# EAGLE design Garage_Pi (EAGLE 7.4.0)
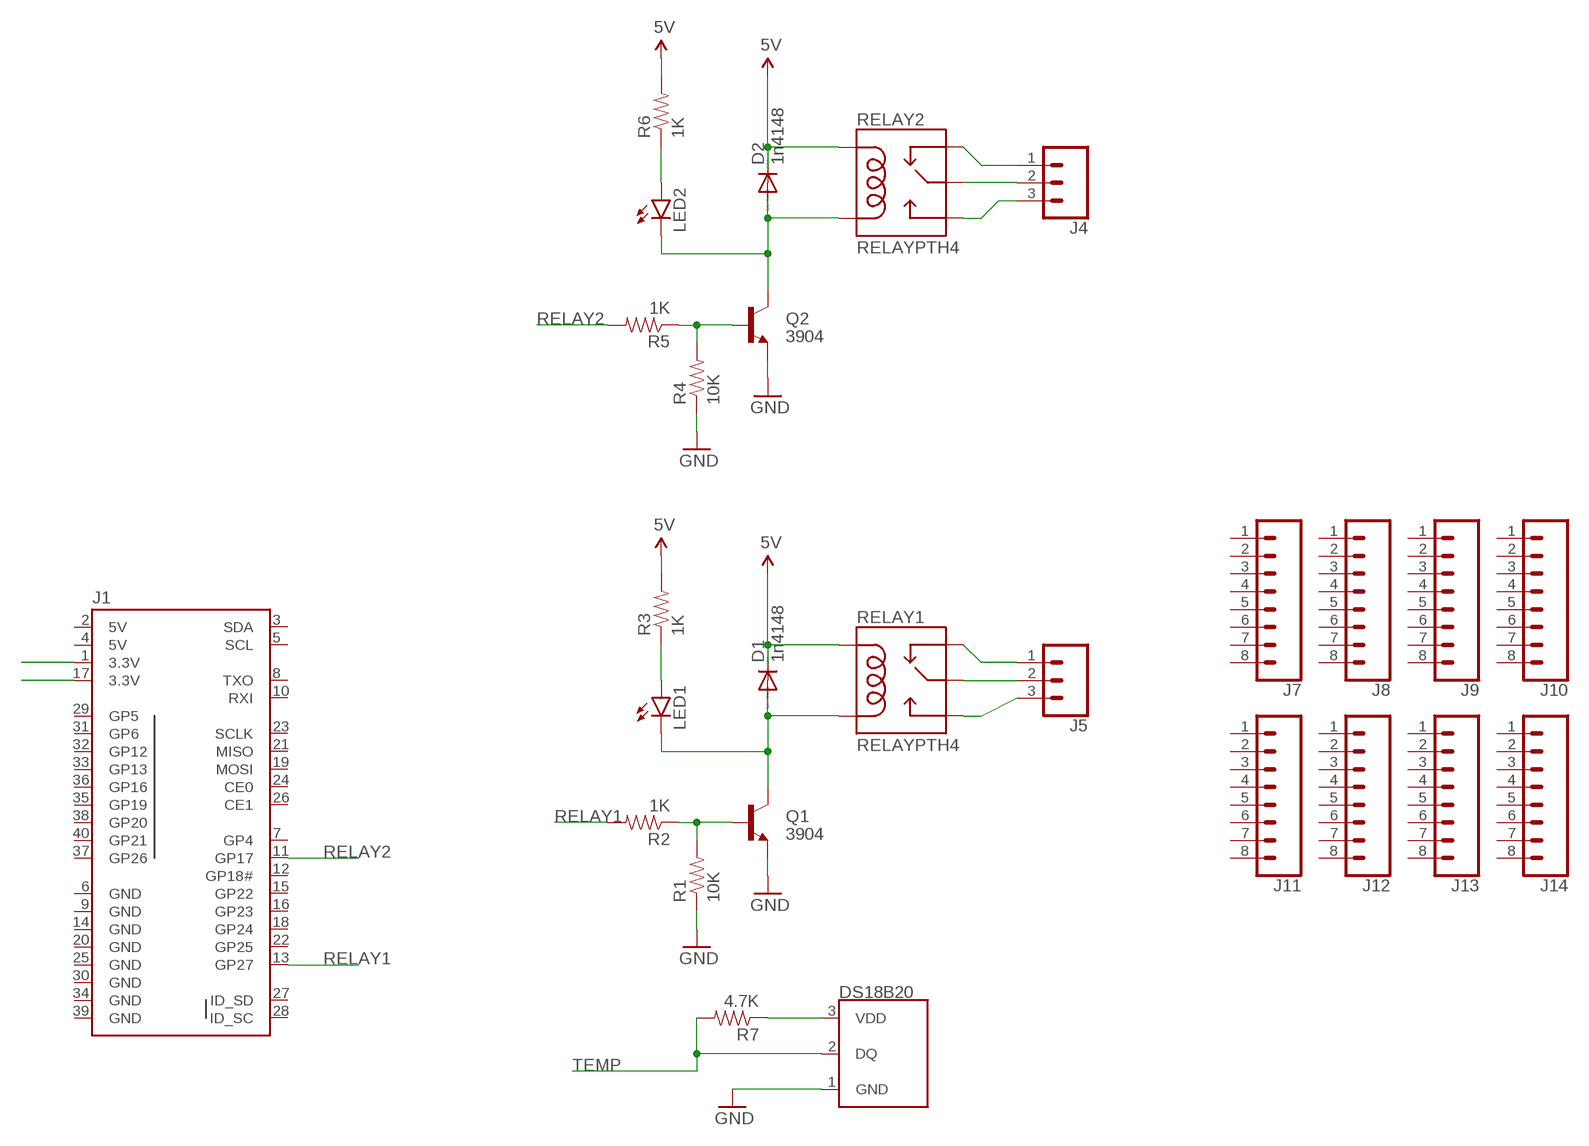
[diagram p0: schematic, sheet 1]

## Parts
D1  1n4148  CGRM4001-G  [SOD-123_MINI-SMA]
D2  1n4148  CGRM4001-G  [SOD-123_MINI-SMA]
DS18B20  DS18B20  [TO-92-AMMO]
J1  RASPBERRYPI-40-PIN-GPIO_PTH  [2X20_SHROUDED]
J4  CONN_03SCREW  [SCREWTERMINAL-3.5MM-3]
J5  CONN_03SCREW  [SCREWTERMINAL-3.5MM-3]
J7  CONN_08NO_SILK_FEMALE_PTH  [1X08_NO_SILK]
J8  CONN_08NO_SILK_FEMALE_PTH  [1X08_NO_SILK]
J9  CONN_08NO_SILK_FEMALE_PTH  [1X08_NO_SILK]
J10  CONN_08NO_SILK_FEMALE_PTH  [1X08_NO_SILK]
J11  CONN_08NO_SILK_FEMALE_PTH  [1X08_NO_SILK]
J12  CONN_08NO_SILK_FEMALE_PTH  [1X08_NO_SILK]
J13  CONN_08NO_SILK_FEMALE_PTH  [1X08_NO_SILK]
J14  CONN_08NO_SILK_FEMALE_PTH  [1X08_NO_SILK]
LED1  LED-FKIT-1206  [FKIT-LED-1206]
LED2  LED-FKIT-1206  [FKIT-LED-1206]
Q1  3904  TRANSISTOR_NPNSOT23-3  [SOT23-3]
Q2  3904  TRANSISTOR_NPNSOT23-3  [SOT23-3]
R1  10K  RESISTOR0805-RES  [0805]
R2  1K  RESISTOR0805-RES  [0805]
R3  1K  RESISTOR0805-RES  [0805]
R4  10K  RESISTOR0805-RES  [0805]
R5  1K  RESISTOR0805-RES  [0805]
R6  1K  RESISTOR0805-RES  [0805]
R7  4.7K  RESISTOR0805-RES  [0805]
RELAY1  RELAYPTH4  [RELAY-JZC]
RELAY2  RELAYPTH4  [RELAY-JZC]

## Nets
3.3V: DS18B20.3(VDD) J1.1(3.3V) R7.1
5V: D1.C D2.C R3.2 R6.2 RELAY1.5(COIL1) RELAY2.5(COIL1)
COM1: J5.2 RELAY1.4(MAIN)
COM2: J4.2 RELAY2.4(MAIN)
GND: DS18B20.1(GND) Q1.2(E) Q2.2(E) R1.1 R4.1
N$1: Q1.1(B) R1.2 R2.1
N$2: D1.A LED1.C Q1.3(C) RELAY1.1(COIL2)
N$4: LED1.A R3.1
N$5: J1.17(3.3V)
N$7: D2.A LED2.C Q2.3(C) RELAY2.1(COIL2)
N$8: Q2.1(B) R4.2 R5.1
N$9: LED2.A R6.1
NC1: J5.1 RELAY1.2(NC)
NC2: J4.1 RELAY2.2(NC)
NO1: J5.3 RELAY1.3(NO)
NO2: J4.3 RELAY2.3(NO)
RELAY1: J1.13(GP27) R2.2
RELAY2: J1.11(GP17) R5.2
TEMP: DS18B20.2(DQ) R7.2
Unconnected: J1.3(SDA) J1.5(SCL) J1.7(GP4) J1.8(TXO) J1.10(RXI) J1.12(GP18#) J1.15(GP22) J1.16(GP23) J1.18(GP24) J1.19(MOSI) J1.21(MISO) J1.22(GP25) J1.23(SCLK) J1.24(CE0) J1.26(CE1) J1.27(ID_SD) J1.28(ID_SC) J1.29(GP5) J1.31(GP6) J1.32(GP12) J1.33(GP13) J1.35(GP19) J1.36(GP16) J1.37(GP26) J1.38(GP20) J1.40(GP21) J7.1 J7.2 J7.3 J7.4 J7.5 J7.6 J7.7 J7.8 J8.1 J8.2 J8.3 J8.4 J8.5 J8.6 J8.7 J8.8 J9.1 J9.2 J9.3 J9.4 J9.5 J9.6 J9.7 J9.8 J10.1 J10.2 J10.3 J10.4 J10.5 J10.6 J10.7 J10.8 J11.1 J11.2 J11.3 J11.4 J11.5 J11.6 J11.7 J11.8 J12.1 J12.2 J12.3 J12.4 J12.5 J12.6 J12.7 J12.8 J13.1 J13.2 J13.3 J13.4 J13.5 J13.6 J13.7 J13.8 J14.1 J14.2 J14.3 J14.4 J14.5 J14.6 J14.7 J14.8

## Power pins joined to a net without a drawn wire
5V: J1.2(5V) J1.4(5V)
GND: J1.6(GND) J1.9(GND) J1.14(GND) J1.20(GND) J1.25(GND) J1.30(GND) J1.34(GND) J1.39(GND)

## Library data of the parts
D1 D2 = diode:CGRM400*-G: Molded plasitc,JEDEC SOD-123/Mini SMA Source: Comchip CGRM4001-G.pdf
DS18B20 = SparkFun-Sensors:DS18B20: Dallas/Maxim DS18B20 1-Wire Temperature Sensor The DS18B20 reports degrees C with 9 to 12-bit precision, -55C to 125C (+/-0.5C). Each sensor has a unique 64-Bit Serial number etched into it - allows for a huge number of sensors to be used on one data bus. Datasheet <http://datasheets.maximintegrated.com/en/ds/DS18B20.pdf> SparkFun Products One Wire Digital Temperature Sensor - DS18B20 <https://www.sparkfun.com/products/245> (SEN-00245); STORE_ID: SEN-00245
J1 = SparkFun-Connectors:RASPBERRYPI-40-PIN-GPIO: Raspberry Pi GPIO Header 2x20 pin connector, as found on B, B+, A+ models. Both shrouded PTH and SMT versions available. SparkFun Products: GPIO Shrouded Header <https://www.sparkfun.com/products/13054>- PTH SparkFun Pi Wedge (Preassembled) <https://www.sparkfun.com/products/13717>; PROD_ID: CONN-12263; SF_ID: PRT-13054
J4 J5 = SparkFun-Connectors:CONN_03: Multi connection point. Often used as Generic Header-pin footprint for 0.1 inch spaced/style header connections On any of the 0.1 inch spaced packages, you can populate with these: Break Away Headers - Straight <https://www.sparkfun.com/products/116> (PRT-00116) Break Away Male Headers - Right Angle <https://www.sparkfun.com/products/553> (PRT-00553) Female Headers <https://www.sparkfun.com/products/115> (PRT-00115) Break Away Headers - Machine Pin <https://www.sparkfun.com/products/117> (PRT-00117) Break Away Female Headers - Swiss Machine Pin <https://www.sparkfun.com/products/743> (PRT-00743) Stackable Header - 3 Pin (Female, 0.1") <https://www.sparkfun.com/products/13875> (PRT-13875) For SCREWTERMINALS and SPRING TERMINALS visit here: Screw Terimnals on SparkFun.com <https://www.sparkfun.com/search/results?term=Screw+Terminals> (5mm/3.5mm/2.54mm spacing) This device is also useful as a general connection point to wire up your design to another part of your project. Our various solder wires solder well into these plated through hole pads. Hook-Up Wire - Assortment (Stranded, 22 AWG) <https://www.sparkfun.com/products/11375> (PRT-11375) Hook-Up Wire - Assortment (Solid Core, 22 AWG) <https://www.sparkfun.com/products/11367> (PRT-11367) View the entire wire category on our website here <https://www.sparkfun.com/categories/141> Special notes: Molex polarized connector foot print use with SKU : PRT-08232 with associated crimp pins and housings.; PROD_ID: CONN-08288; SF_ID: PRT-08235
J7-J14 = SparkFun-Connectors:CONN_08: Multi connection point. Often used as Generic Header-pin footprint for 0.1 inch spaced/style header connections On any of the 0.1 inch spaced packages, you can populate with these: Break Away Headers - Straight <https://www.sparkfun.com/products/116> (PRT-00116) Break Away Male Headers - Right Angle <https://www.sparkfun.com/products/553> (PRT-00553) Female Headers <https://www.sparkfun.com/products/115> (PRT-00115) Break Away Headers - Machine Pin <https://www.sparkfun.com/products/117> (PRT-00117) Break Away Female Headers - Swiss Machine Pin <https://www.sparkfun.com/products/743> (PRT-00743) Arduino Stackable Header - 8 Pin <https://www.sparkfun.com/products/9279> (PRT-09279) For SCREWTERMINALS and SPRING TERMINALS visit here: Screw Terimnals on SparkFun.com <https://www.sparkfun.com/search/results?term=Screw+Terminals> (5mm/3.5mm/2.54mm spacing) This device is also useful as a general connection point to wire up your design to another part of your project. Our various solder wires solder well into these plated through hole pads. Hook-Up Wire - Assortment (Stranded, 22 AWG) <https://www.sparkfun.com/products/11375> (PRT-11375) Hook-Up Wire - Assortment (Solid Core, 22 AWG) <https://www.sparkfun.com/products/11367> (PRT-11367) View the entire wire category on our website here <https://www.sparkfun.com/categories/141> Special notes: Molex polarized connector foot print use with SKU : PRT-08231 with associated crimp pins and housings. 1MM SMD Version SKU: PRT-10208 NOTES ON THE VARIANTS LOCK and LOCK_LONGPADS... This footprint was designed to help hold the alignment of a through-hole component (i.e. 6-pin header) while soldering it into place. You may notice that each hole has been shifted either up or down by 0.005 of an inch from it's more standard position (which is a perfectly straight line). This slight alteration caused the pins (the squares in the middle) to touch the edges of the holes. Because they are alternating, it causes a "brace" to hold the component in place. 0.005 has proven to be the perfect amount of "off-center" position when using our standard breakaway headers. Although looks a little odd when you look at the bare footprint, once you have a header in there, the alteration is very hard to notice. Also,if you push a header all the way into place, it is covered up entirely on the bottom side.; PROD_ID: CONN-08438
LED1 LED2 = SparkFun-LED:LED: LEDs Standard schematic elements and footprints for 5mm, 3mm, 1206, and 0603 sized LEDs. 5mm - Spark Fun Electronics SKU : COM-00529 (and others)
Q1 Q2 = SparkFun-DiscreteSemi:TRANSISTOR_NPN: Generic NPN BJT MMBT2222A - TRANS-08049 (SOT-23, 1A 40V) MPSA42 - TRANS-09116 (SOT-23, 500mA 300V) MMBT5088LT1G - TRANS-11160 (SOT-23, 50 mA 30V) BC547 - COM-08928 <http://www.sparkfun.com/products/8928> (TO-92 45V 100mA) (1.Collector 2.Base 3.Emitter) 2N3904 - COM-00521 <http://www.sparkfun.com/products/521> (TO-92 40V 200mA) (1.Emitter 2.Base 3.Collector) P2N2222A - COM-12852 <http://www.sparkfun.com/products/12852> (TO-92 40V 600mA) (1.Collector 2.Base 3.Emitter); PROD_ID: TRANS-08049
R1-R7 = SparkFun-Passives:RESISTOR: Resistor Basic schematic elements and footprints for 0603, 1206, and PTH resistors.
RELAY1 RELAY2 = SparkFun-Electromechanical:RELAY: SPDT relay (COM-00101)

## Board
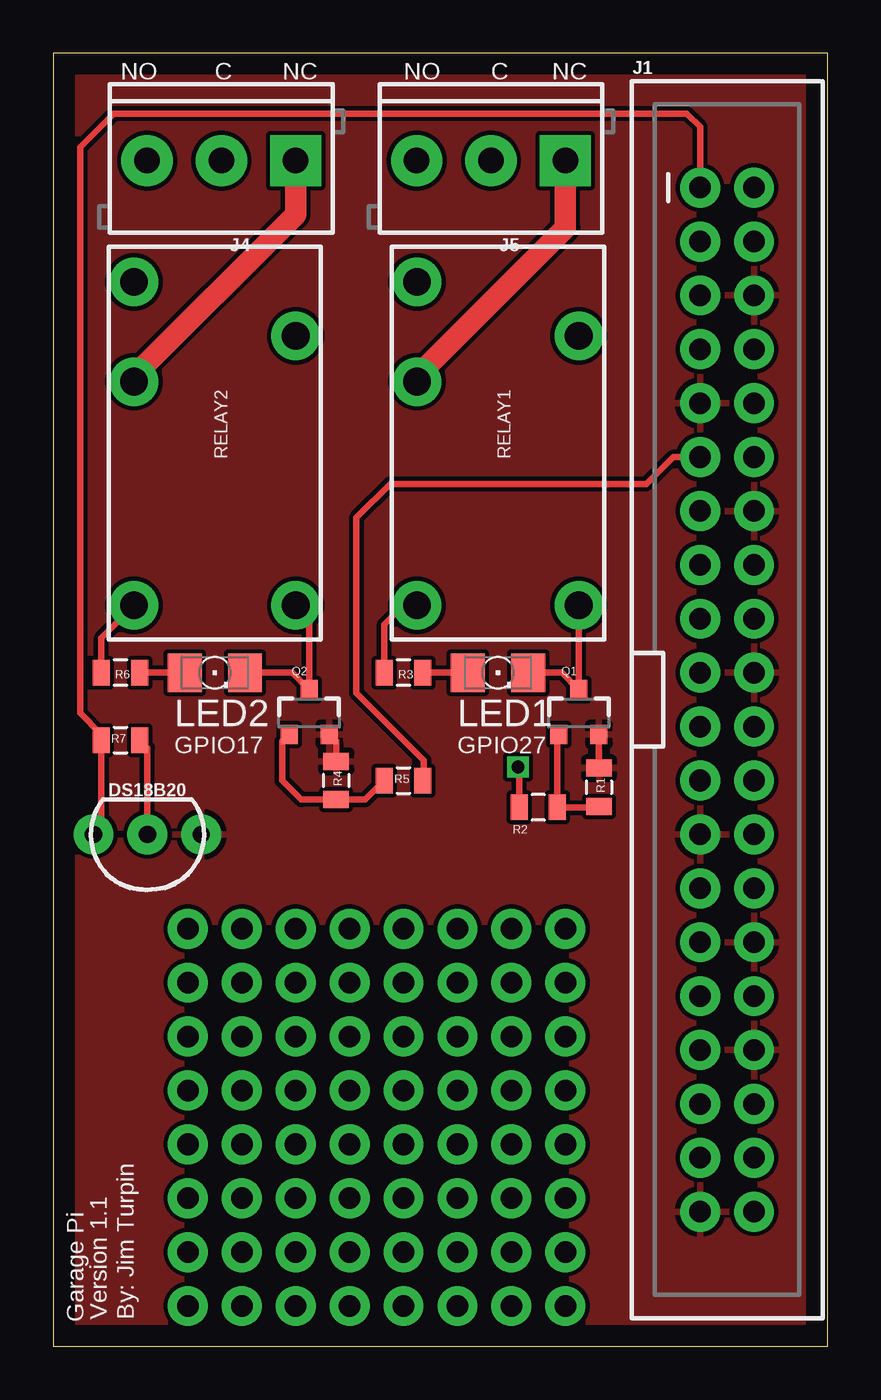
[diagram p1: board, top side]
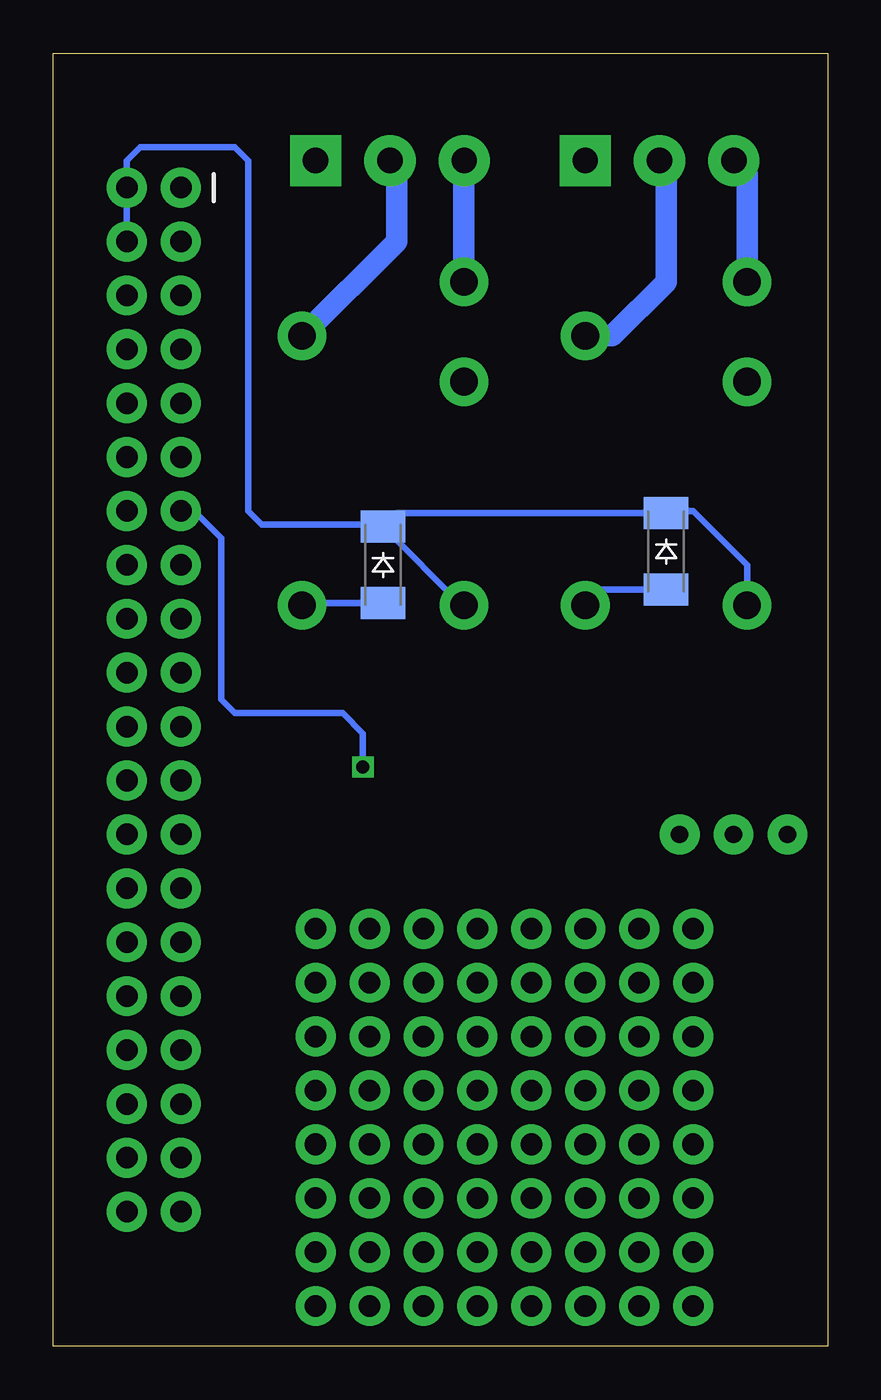
[diagram p2: board, bottom side, seen from below]

Size 36.5 x 60.95 mm. Coordinates in mm from the lower left corner, seen from the top.
Outline: 0,0 36.5,0 36.5,60.95 0,60.95 0,0
Copper layers (1*16): Top 0.035mm / dielectric 1.5mm / Bottom 0.035mm
Design rules "default": minimum track width 10mil, minimum drill 24mil, track to track 8mil, track to pad 8mil, pad to pad 8mil, via to via 8mil, smd to smd 8mil, copper to edge 40mil, drill to drill 8mil, minimum pad ring 10mil, minimum via ring 8mil, stop-mask expansion 4mil, vias tented up to drill 0mil, thermal gap 10mil

### Footprints (pad centres in the part's own frame; a part is rotated, then mirrored left to right if it is on the bottom)
SOD-123_MINI-SMA = smd 1.5 x 2.1: A 1.8,0; C -1.8,0
TO-92-AMMO = drill 0.813 pad 1.88: 1 -2.54,0; 2 0,0; 3 2.54,0
2X20_SHROUDED = drill 1.016 pad 1.88: 1 -1.27,24.13; 2 1.27,24.13; 3 -1.27,21.59; 4 1.27,21.59; 5 -1.27,19.05; 6 1.27,19.05; 7 -1.27,16.51; 8 1.27,16.51; 9 -1.27,13.97; 10 1.27,13.97; 11 -1.27,11.43; 12 1.27,11.43; 13 -1.27,8.89; 14 1.27,8.89; 15 -1.27,6.35; 16 1.27,6.35; 17 -1.27,3.81; 18 1.27,3.81; 19 -1.27,1.27; 20 1.27,1.27; 21 -1.27,-1.27; 22 1.27,-1.27; 23 -1.27,-3.81; 24 1.27,-3.81; 25 -1.27,-6.35; 26 1.27,-6.35; 27 -1.27,-8.89; 28 1.27,-8.89; 29 -1.27,-11.43; 30 1.27,-11.43; 31 -1.27,-13.97; 32 1.27,-13.97; 33 -1.27,-16.51; 34 1.27,-16.51; 35 -1.27,-19.05; 36 1.27,-19.05; 37 -1.27,-21.59; 38 1.27,-21.59; 39 -1.27,-24.13; 40 1.27,-24.13
SCREWTERMINAL-3.5MM-3 = drill 1.2 pad 2.413 square: 1 0,0 | drill 1.2 pad 2.413: 2 3.5,0; 3 7,0
1X08_NO_SILK = drill 1.016 pad 1.88: 1 0,0; 2 2.54,0; 3 5.08,0; 4 7.62,0; 5 10.16,0; 6 12.7,0; 7 15.24,0; 8 17.78,0
FKIT-LED-1206 = smd 1.6 x 1.803: A -1.422,0; C 1.422,0
SOT23-3 = smd 0.8 x 0.9: 1 -0.95,-1; 2 0.95,-1; 3 0,1.1
0805 = smd 0.8 x 1.2: 1 -0.9,0; 2 0.9,0
RELAY-JZC = drill 1.3 pad 2.286: 1 3.81,-8.89; 2 -3.81,1.651; 3 -3.81,6.35; 4 3.81,3.81; 5 -3.81,-8.89

### Placement (x,y rotation side)
D1  20.95,36.83 270 bottom
D2  7.62,37.47 270 bottom
DS18B20  4.45,24.13 180 top
J1  31.75,30.48 0 top
J4  11.43,55.88 180 top
J5  24.13,55.88 180 top
J7  6.35,19.68 0 top
J8  6.35,14.61 0 top
J9  6.35,17.14 0 top
J10  6.35,1.91 0 top
J11  6.35,4.45 0 top
J12  6.35,6.99 0 top
J13  6.35,9.53 0 top
J14  6.35,12.06 0 top
LED1  20.95,31.75 0 top
LED2  7.62,31.75 0 top
Q1  24.77,29.84 0 top
Q2  12.06,29.84 0 top
R1  25.72,26.35 270 top
R2  22.86,25.4 180 top
R3  16.51,31.75 180 top
R4  13.34,26.67 270 top
R5  16.51,26.67 0 top
R6  3.17,31.75 180 top
R7  3.17,28.57 0 top
RELAY1  20.95,43.81 0 top
RELAY2  7.62,43.81 0 top

### Tracks (layer width: path | path; a pad name or v marks a point on that pad's centre or on a via)
3.3V
  Top 0.305: J1.1 30.48,57.47 29.84,58.1 2.86,58.1 1.27,56.52 1.27,29.84 2.27,28.84 R7.1 2.27,24.5 DS18B20.3
5V
  Top 0.305: R6.2 2.27,33.39 RELAY2.5 | R3.2 15.61,34.02 16.51,34.92 RELAY1.5
  Bottom 0.305: J1.2 J1.4 33.02,55.88 32.38,56.52 27.94,56.52 27.3,55.88 27.3,39.37 26.67,38.73 21.06,38.73 D1.C | RELAY2.5 3.81,36.83 6.35,39.37 7.51,39.37 D2.C 20.32,39.27 D1.C | RELAY1.5 17.25,34.92 D1.C
COM1
  Bottom 1.016: RELAY1.4 20.32,52.07 20.32,55.57 J5.2
COM2
  Bottom 1.016: RELAY2.4 10.16,47.62 7.62,50.16 7.62,55.57 J4.2
GND
  Top 0.305: R4.1 13.34,28.52 Q2.2 | Q1.2 R1.1
  pour Top: 0,0 0,60.96 36.51,60.96 36.51,0
N$1
  Top 0.305: R1.2 25.66,25.4 R2.1 23.76,28.79 Q1.1
N$2
  Top 0.305: RELAY1.1 Q1.3 23.96,31.75 LED1.C
  Bottom 0.305: D1.A 24.66,35.03 RELAY1.1
N$4
  Top 0.305: R3.1 LED1.A
N$7
  Top 0.305: RELAY2.1 12.06,34.29 Q2.3 11.26,31.75 LED2.C
  Bottom 0.305: D2.A 10.69,35.66 RELAY2.1
N$8
  Top 0.305: Q2.1 10.79,28.52 10.79,26.67 11.7,25.77 R4.2 14.71,25.77 R5.1
N$9
  Top 0.305: R6.1 LED2.A
NC1
  Top 1.016: RELAY1.2 17.14,45.72 24.13,52.7 J5.1
NC2
  Top 1.016: RELAY2.2 3.81,45.72 11.43,53.34 J4.1
NO1
  Bottom 1.016: RELAY1.3 17.14,55.87 J5.3
NO2
  Bottom 1.016: RELAY2.3 3.81,55.26 J4.3
RELAY1  (via drill 0.6)
  Top 0.305: R2.2 21.96,27.25 v21.91,27.3
  Bottom 0.305: v21.91,27.3 21.91,28.89 22.86,29.84 27.94,29.84 28.57,30.48 28.57,38.1 29.84,39.37 J1.13
RELAY2
  Top 0.305: J1.11 29.21,41.91 27.94,40.64 15.88,40.64 14.29,39.05 14.29,30.8 17.46,27.62 17.46,26.72 R5.2
TEMP
  Top 0.305: DS18B20.2 4.45,28.2 R7.2

### Text on the board
tNames: NO | C | NC | NO | C | NC | GPIO17 | GPIO27 | Garage Pi | Version 1.1 | By: Jim Turpin
bValues: Documentation: / https://github.com/JTurpin/GaragePi